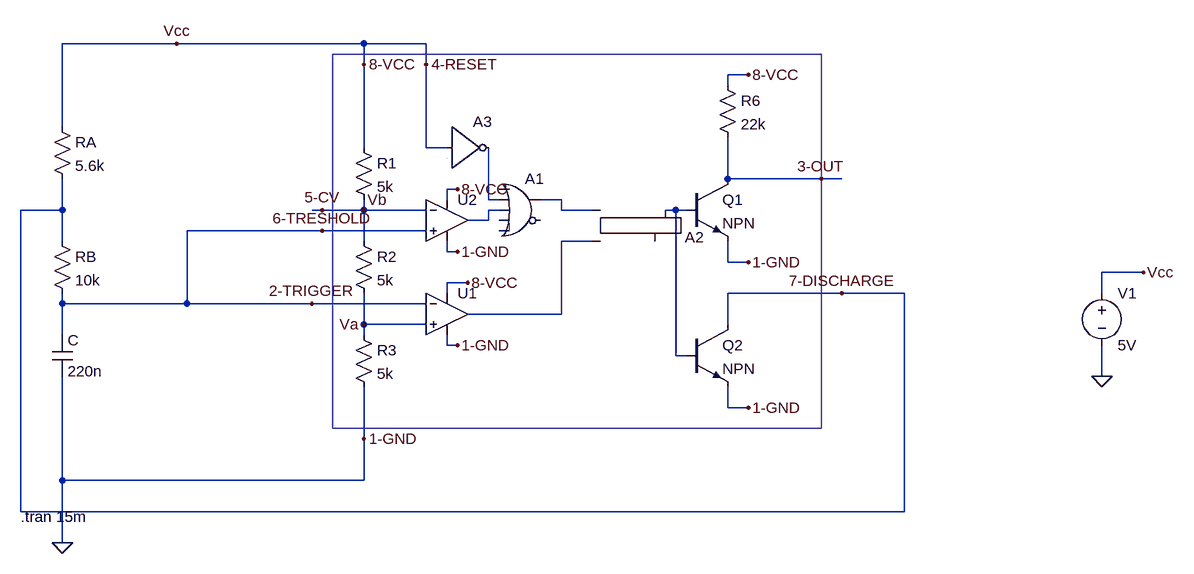
[diagram p0: schematic 555-Astable-Interne.asc]
555-Astable-Interne.asc, the LTspice schematic file:
Version 4
SHEET 1 1200 680
WIRE -352 -128 -528 -128
WIRE -64 -128 -352 -128
WIRE 32 -128 -64 -128
WIRE -64 -96 -64 -128
WIRE 32 -96 32 -128
WIRE 528 -80 496 -80
WIRE 496 -64 496 -80
WIRE -528 0 -528 -128
WIRE -64 32 -64 -96
WIRE 32 32 32 -96
WIRE 64 32 32 32
WIRE 496 80 496 16
WIRE 640 80 496 80
WIRE 672 80 640 80
WIRE 80 96 64 96
WIRE 64 112 64 96
WIRE 128 112 128 32
WIRE 144 112 128 112
WIRE 240 112 208 112
WIRE -528 128 -528 80
WIRE -528 128 -592 128
WIRE -128 128 -144 128
WIRE -64 128 -64 112
WIRE -64 128 -128 128
WIRE 32 128 -64 128
WIRE 144 128 128 128
WIRE 240 128 240 112
WIRE 288 128 240 128
WIRE 416 128 400 128
WIRE 432 128 416 128
WIRE 128 144 128 128
WIRE 128 144 96 144
WIRE -128 160 -336 160
WIRE 32 160 -128 160
WIRE -528 176 -528 128
WIRE -64 176 -64 128
WIRE 288 176 240 176
WIRE 64 192 64 176
WIRE 80 192 64 192
WIRE 496 208 496 176
WIRE 528 208 496 208
WIRE 1136 224 1072 224
WIRE 96 240 64 240
WIRE 64 256 64 240
WIRE 672 256 496 256
WIRE 768 256 672 256
WIRE 1072 256 1072 224
WIRE -528 272 -528 256
WIRE -336 272 -336 160
WIRE -336 272 -528 272
WIRE -144 272 -336 272
WIRE 32 272 -144 272
WIRE 240 288 240 176
WIRE 240 288 96 288
WIRE -64 304 -64 256
WIRE 32 304 -64 304
WIRE 496 304 496 256
WIRE -528 320 -528 272
WIRE -64 320 -64 304
WIRE 64 336 64 320
WIRE 80 336 64 336
WIRE 416 352 416 128
WIRE 432 352 416 352
WIRE 1072 384 1072 336
WIRE 496 432 496 400
WIRE 528 432 496 432
WIRE -64 480 -64 400
WIRE -528 544 -528 384
WIRE -64 544 -64 480
WIRE -64 544 -528 544
WIRE -592 592 -592 128
WIRE 768 592 768 256
WIRE 768 592 -592 592
WIRE -528 640 -528 544
FLAG 1072 384 0
FLAG 1136 224 Vcc
FLAG 640 80 3-OUT
FLAG 672 256 7-DISCHARGE
FLAG -128 160 6-TRESHOLD
FLAG 80 96 8-VCC
FLAG 96 240 8-VCC
FLAG 80 192 1-GND
FLAG 80 336 1-GND
FLAG -144 272 2-TRIGGER
FLAG -128 128 5-CV
FLAG -528 640 0
FLAG -352 -128 Vcc
FLAG 528 208 1-GND
FLAG 528 432 1-GND
FLAG 528 -80 8-VCC
FLAG -64 -96 8-VCC
FLAG -64 480 1-GND
FLAG 32 -96 4-RESET
FLAG -64 128 Vb
FLAG -64 304 Va
SYMBOL Digital\\or 176 64 R0
SYMATTR InstName A1
SYMBOL npn 432 304 R0
SYMATTR InstName Q2
SYMBOL res -80 16 R0
SYMATTR InstName R1
SYMATTR Value 5k
SYMBOL res -80 160 R0
SYMATTR InstName R2
SYMATTR Value 5k
SYMBOL res -80 304 R0
SYMATTR InstName R3
SYMATTR Value 5k
SYMBOL Opamps\\UniversalOpamp2 64 144 R0
SYMATTR InstName U2
SYMBOL Opamps\\UniversalOpamp2 64 288 R0
SYMATTR InstName U1
SYMBOL Digital\\inv 64 -32 R0
SYMATTR InstName A3
SYMBOL res -544 -16 R0
SYMATTR InstName RA
SYMATTR Value 5.6k
SYMBOL res -544 160 R0
SYMATTR InstName RB
SYMATTR Value 10k
SYMBOL cap -544 320 R0
SYMATTR InstName C
SYMATTR Value 220n
SYMBOL voltage 1072 240 R0
WINDOW 123 0 0 Left 0
WINDOW 39 0 0 Left 0
SYMATTR InstName V1
SYMATTR Value 5V
SYMBOL npn 432 80 R0
SYMATTR InstName Q1
SYMBOL res 480 -80 R0
SYMATTR InstName R6
SYMATTR Value 22k
SYMBOL Digital\\srflop 336 224 M180
SYMATTR InstName A2
TEXT -592 600 Left 0 !.tran 15m
RECTANGLE Normal 640 464 -112 -112

The netlist it stands for:
* 555-Astable-Interne.asc
A1 0 N001 N003 0 0 0 N002 0 OR
Q2 7-DISCHARGE N004 0 0 NPN
R1 4-RESET Vb 5k
R2 Vb Va 5k
R3 Va 0 5k
XU2 2-TRIGGER Vb 4-RESET 0 N003 level.2 Avol=1Meg GBW=10Meg Slew=10Meg ilimit=25m rail=0 Vos=0 phimargin=45 en=0 enk=0 in=0 ink=0 Rin=500Meg  ; pins IN+ IN- V+ V- OUT
XU1 Va 2-TRIGGER 4-RESET 0 N005 level.2 Avol=1Meg GBW=10Meg Slew=10Meg ilimit=25m rail=0 Vos=0 phimargin=45 en=0 enk=0 in=0 ink=0 Rin=500Meg  ; pins IN+ IN- V+ V- OUT
A3 4-RESET 0 0 0 0 N001 0 0 BUF
RA 4-RESET 7-DISCHARGE 5.6k
RB 7-DISCHARGE 2-TRIGGER 10k
C 2-TRIGGER 0 220n
V1 4-RESET 0 5V
Q1 3-OUT N004 0 0 NPN
R6 4-RESET 3-OUT 22k
A2 N005 N002 0 0 0 N004 0 0 SRFLOP
.model NPN NPN
.model PNP PNP
.lib standard.bjt
.tran 15m
.lib UniversalOpamps2.sub
.backanno
.end